# EAGLE design v2 (EAGLE 8.2.2)
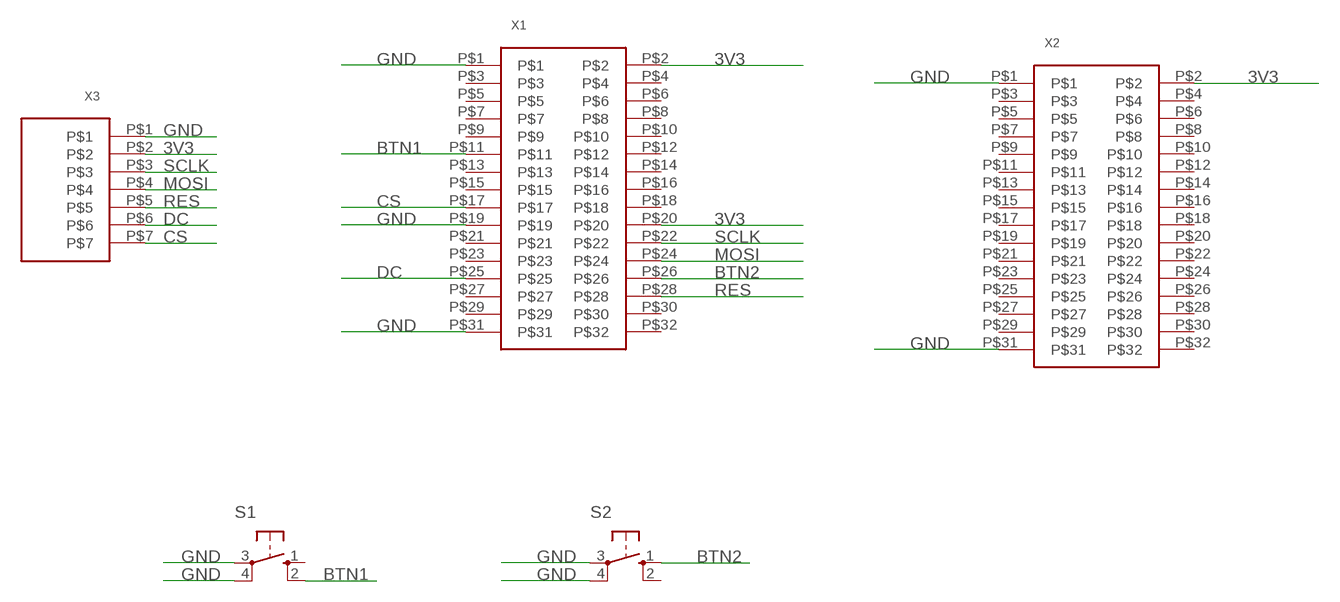
[diagram p0: schematic, sheet 1]

## Parts
S1  S1  40-XX  [B3F-40XX]
S2  S2  40-XX  [B3F-40XX]
X1  2X16-SOCKET-HEADER  [2X16-SOCKET-HEADER]
X2  2X16-SOCKET-HEADER  [2X16-SOCKET-HEADER]
X3  1X7-SOCKET-HEADER  [1X7-SOCKET-HEADER]

## Nets
3V3: X1.P$2 X1.P$20 X2.P$2 X3.P$2
BTN1: S1.2(S1) X1.P$11
BTN2: S2.1(S) X1.P$26
CS: X1.P$17 X3.P$7
DC: X1.P$25 X3.P$6
GND: S1.3(P) S1.4(P1) S2.3(P) S2.4(P1) X1.P$1 X1.P$19 X1.P$31 X2.P$1 X2.P$31 X3.P$1
MOSI: X1.P$24 X3.P$4
RES: X1.P$28 X3.P$5
SCLK: X1.P$22 X3.P$3
Unconnected: S1.1(S) S2.2(S1) X1.P$3 X1.P$4 X1.P$5 X1.P$6 X1.P$7 X1.P$8 X1.P$9 X1.P$10 X1.P$12 X1.P$13 X1.P$14 X1.P$15 X1.P$16 X1.P$18 X1.P$21 X1.P$23 X1.P$27 X1.P$29 X1.P$30 X1.P$32 X2.P$3 X2.P$4 X2.P$5 X2.P$6 X2.P$7 X2.P$8 X2.P$9 X2.P$10 X2.P$11 X2.P$12 X2.P$13 X2.P$14 X2.P$15 X2.P$16 X2.P$17 X2.P$18 X2.P$19 X2.P$20 X2.P$21 X2.P$22 X2.P$23 X2.P$24 X2.P$25 X2.P$26 X2.P$27 X2.P$28 X2.P$29 X2.P$30 X2.P$32

## Library data of the parts
S1 S2 = v2:40-XX: OMRON SWITCH; MF: OMRON COMPONENTS USA; MPN: B3F-4000; OC_FARNELL: 176434; OC_NEWARK: 36K3105
X1 X2 = v2:2X16-SOCKET-HEADER
X3 = v2:1X7-SOCKET-HEADER

## Board
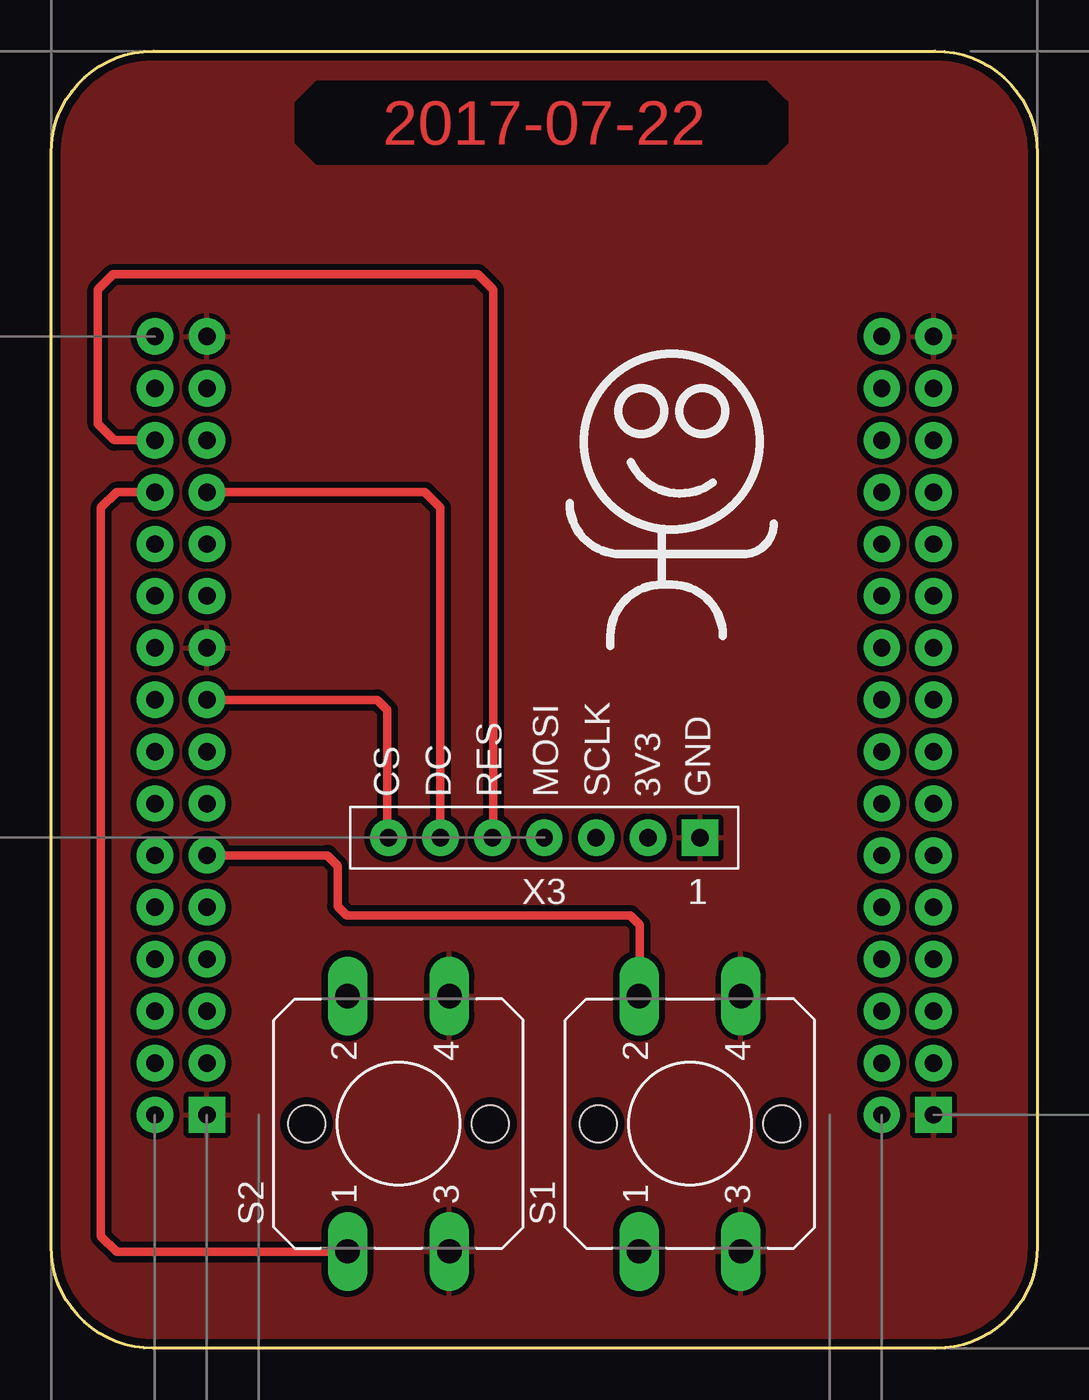
[diagram p1: board, top side]
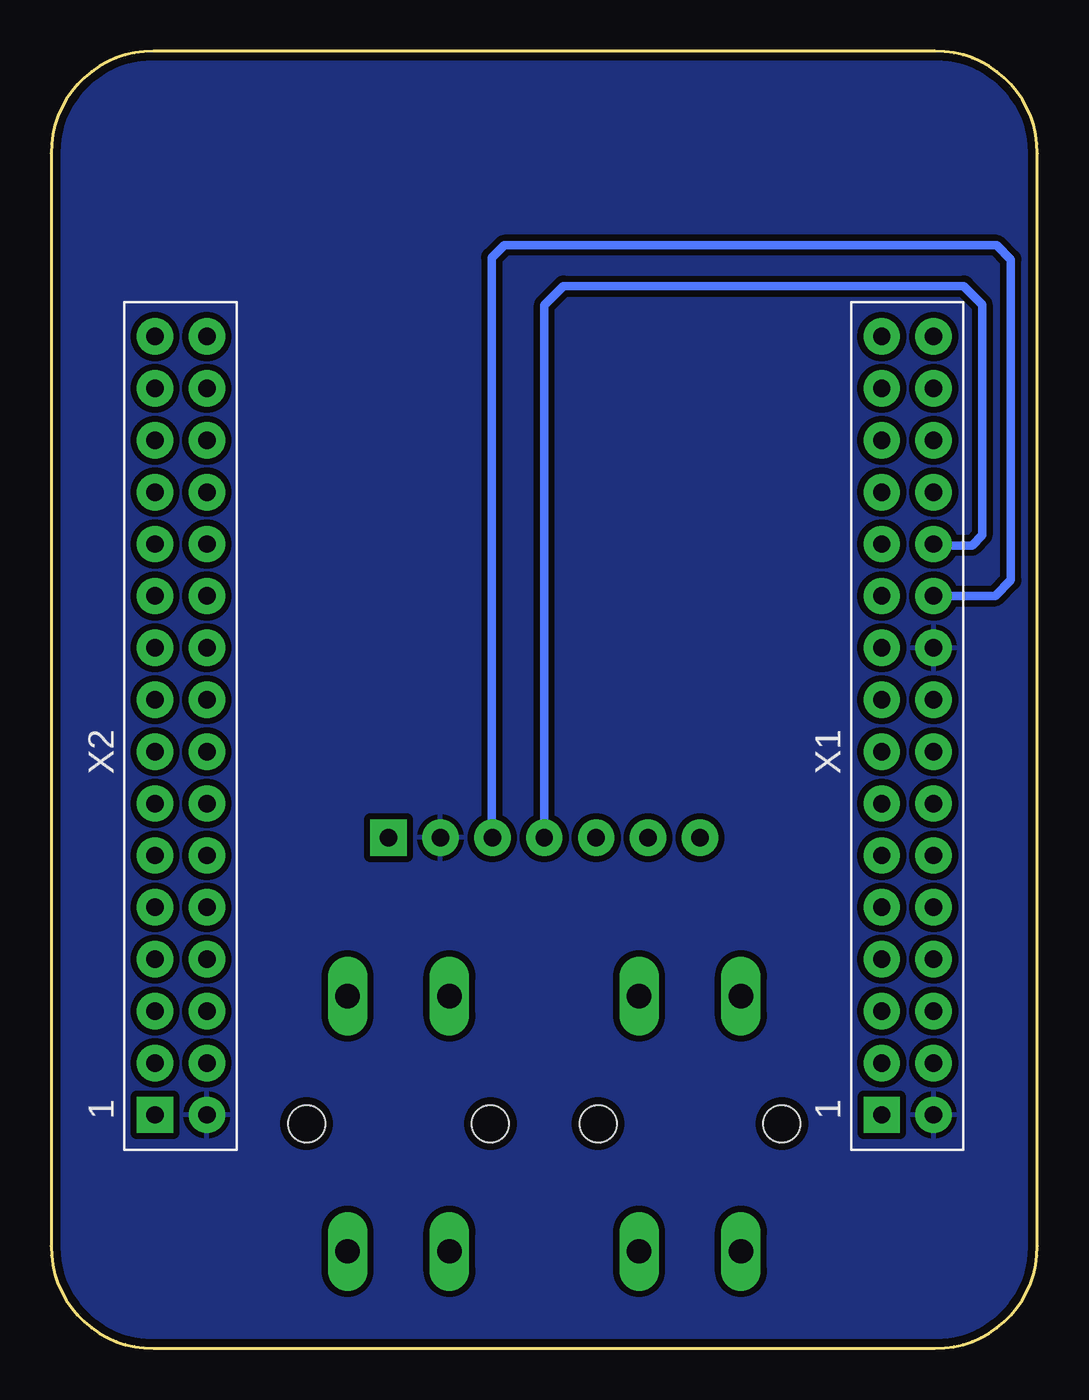
[diagram p2: board, bottom side, seen from below]

Size 48.26 x 63.5 mm. Coordinates in mm from the lower left corner, seen from the top.
Outline: 0,5 0,58.5 arc-90 5,63.5 43.26,63.5 arc-90 48.26,58.5 48.26,5 arc-90 43.26,0 5,0 arc-90 0,5
Copper layers (1*16): Top 0.035559375mm / dielectric 1.6mm / Bottom 0.035559375mm
Design rules "oshpark-2layer": minimum track width 6mil, minimum drill 10mil, track to track 6mil, track to pad 6mil, pad to pad 6mil, via to via 6mil, smd to smd 6mil, copper to edge 15mil, drill to drill 6mil, minimum pad ring 5mil, minimum via ring 5mil, stop-mask expansion 2.5mil, vias tented up to drill 0mil, thermal gap 10mil

### Footprints (pad centres in the part's own frame; a part is rotated, then mirrored left to right if it is on the bottom)
B3F-40XX = drill 1.194 pad 1.93 long: 1 -6.248,2.489; 2 6.248,2.489; 3 -6.248,-2.489; 4 6.248,-2.489 | hole 1.803: 0,-4.496; 0,4.496
2X16-SOCKET-HEADER = drill 0.85 pad 1.778 square: P$1 -17.78,0 | drill 0.85 pad 1.778: P$2 -17.78,-2.54; P$3 -15.24,0; P$4 -15.24,-2.54; P$5 -12.7,0; P$6 -12.7,-2.54; P$7 -10.16,0; P$8 -10.16,-2.54; P$9 -7.62,0; P$10 -7.62,-2.54; P$11 -5.08,0; P$12 -5.08,-2.54; P$13 -2.54,0; P$14 -2.54,-2.54; P$15 0,0; P$16 0,-2.54; P$17 2.54,0; P$18 2.54,-2.54; P$19 5.08,0; P$20 5.08,-2.54; P$21 7.62,0; P$22 7.62,-2.54; P$23 10.16,0; P$24 10.16,-2.54; P$25 12.7,0; P$26 12.7,-2.54; P$27 15.24,0; P$28 15.24,-2.54; P$29 17.78,0; P$30 17.78,-2.54; P$31 20.32,0; P$32 20.32,-2.54
1X7-SOCKET-HEADER = drill 0.85 pad 1.778 square: P$1 -7.62,0 | drill 0.85 pad 1.778: P$2 -5.08,0; P$3 -2.54,0; P$4 0,0; P$5 2.54,0; P$6 5.08,0; P$7 7.62,0

### Placement (x,y rotation side)
S1  31.26,11 90 top
S2  17,11 90 top
X1  7.62,29.21 90 bottom
X2  43.18,29.21 90 bottom
X3  24.13,25 180 top

### Tracks (layer width: path | path; a pad name or v marks a point on that pad's centre or on a via)
3V3
  pour Bottom (isolate 0.305): 0,5 0,58.5 arc-90 5,63.5 43.26,63.5 arc-90 48.26,58.5 48.26,5 arc-90 43.26,0 5,0 arc-90
BTN1
  Top 0.406: X1.P$11 13.51,24.13 14.02,23.62 14.02,21.64 14.48,21.18 28.35,21.18 28.8,20.73 28.8,17.28 S1.2
BTN2
  Top 0.406: X1.P$26 3.2,41.91 2.44,41.15 2.44,5.49 3.2,4.72 14.48,4.72 S2.1
CS
  Top 0.406: X1.P$17 15.95,31.75 16.46,31.24 16.46,25.05 X3.P$7
DC
  Top 0.406: X1.P$25 18.29,41.91 19.05,41.15 X3.P$6
GND
  pour Top (isolate 0.305): 0,5 0,58.5 arc-90 5,63.5 43.26,63.5 arc-90 48.26,58.5 48.26,5 arc-90 43.26,0 5,0 arc-90
MOSI
  Bottom 0.406: X3.P$4 24.13,51.07 23.2,52 3.6,52 2.7,51.1 2.7,39.8 3.2,39.3 5.01,39.3 X1.P$24
N$1
  cutout Top: 12,61 13,62 35,62 36,61 36,59 35,58 13,58 12,59
RES
  Top 0.406: X1.P$28 3.1,44.45 2.29,45.26 2.29,51.82 3.05,52.58 20.88,52.58 21.64,51.82 21.64,25.05 X3.P$5
SCLK
  Bottom 0.406: X1.P$22 2.07,36.83 1.3,37.6 1.3,53.3 2,54 26.1,54 26.7,53.4 26.7,25.03 X3.P$3

### Text on the board
Top: 2017-07-22
tPlace: CS | DC | RES | MOSI | SCLK | 3V3 | GND